# EAGLE design sphere_robo (EAGLE 8.2.2)
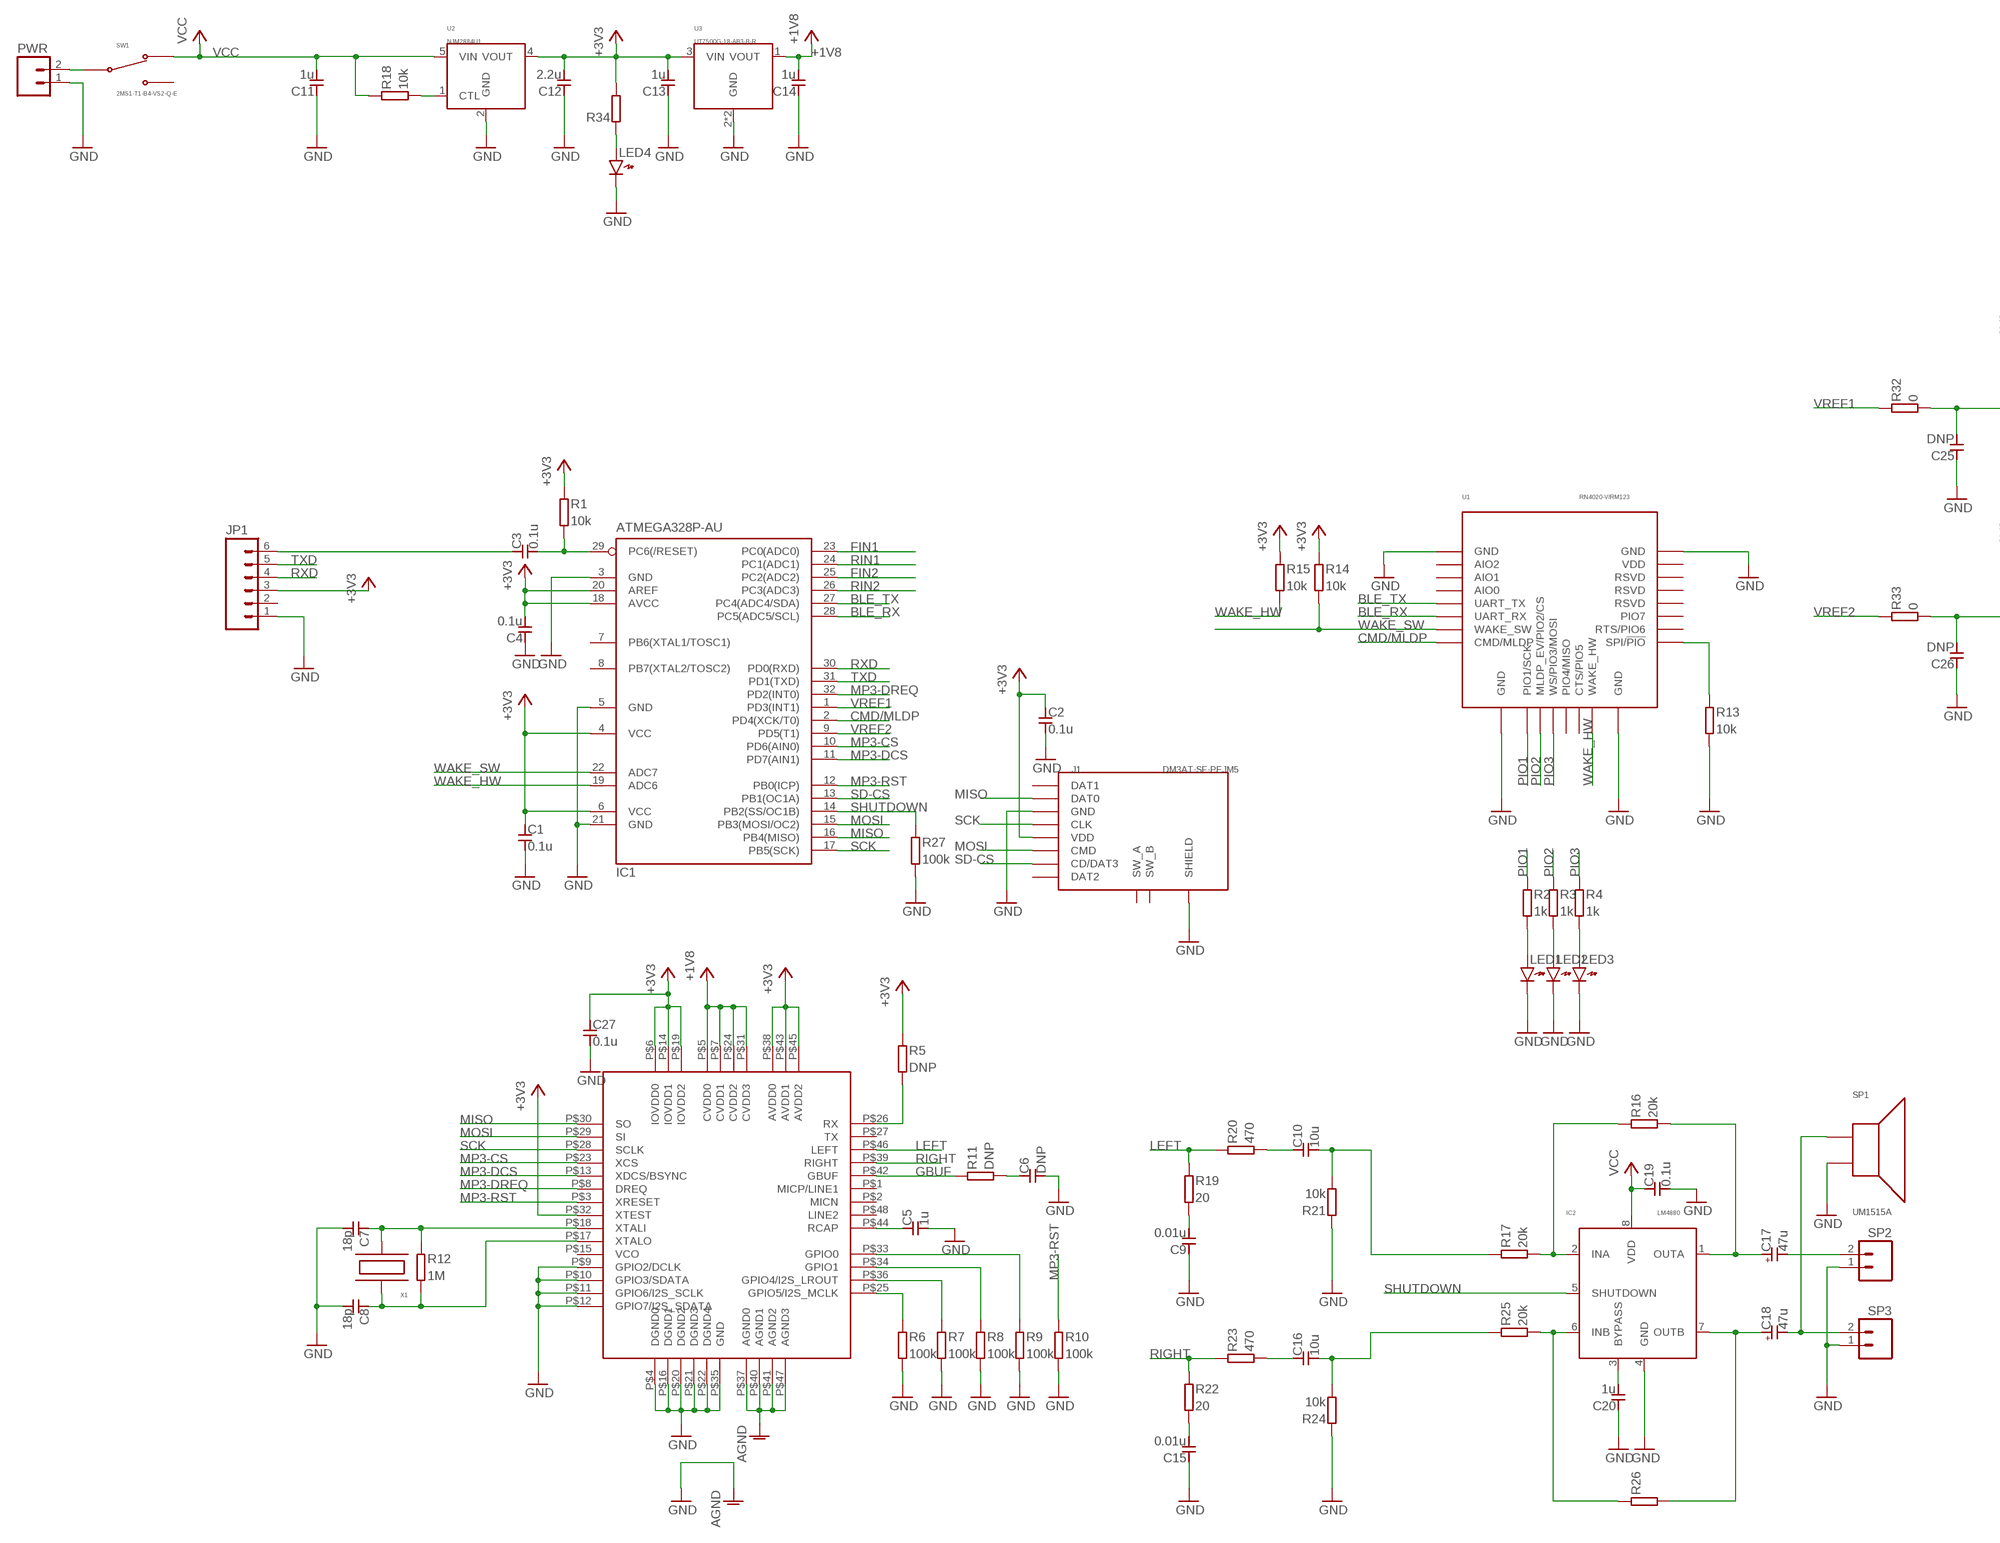
[diagram p0: schematic, sheet 1, part 1 of 2]
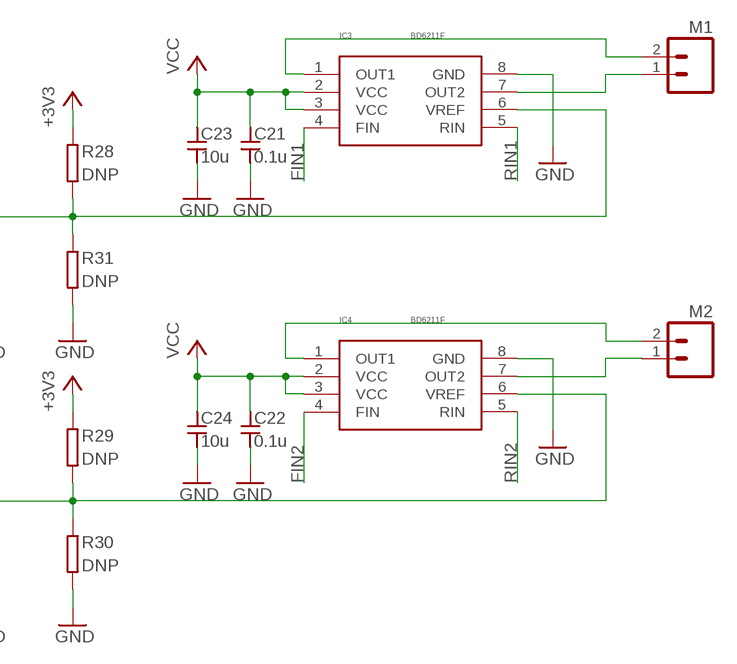
[diagram p1: schematic, sheet 1, part 2 of 2]

## Parts
C1  0.1u  CAPACITOR1608_REDUCED  [SMD1608_REDUCED]
C2  0.1u  CAPACITOR1608_REDUCED  [SMD1608_REDUCED]
C3  0.1u  CAPACITOR1608_REDUCED  [SMD1608_REDUCED]
C4  0.1u  CAPACITOR1608_REDUCED  [SMD1608_REDUCED]
C5  1u  CAPACITOR1608_REDUCED  [SMD1608_REDUCED]
C6  DNP  CAPACITOR1608_REDUCED  [SMD1608_REDUCED]
C7  18p  CAPACITOR1608_REDUCED  [SMD1608_REDUCED]
C8  18p  CAPACITOR1608_REDUCED  [SMD1608_REDUCED]
C9  0.01u  CAPACITOR1608_REDUCED  [SMD1608_REDUCED]
C10  10u  CAPACITOR2012_REDUCED  [SMD2012_REDUCED]
C11  1u  CAPACITOR1608_REDUCED  [SMD1608_REDUCED]
C12  2.2u  CAPACITOR1608_REDUCED  [SMD1608_REDUCED]
C13  1u  CAPACITOR1608_REDUCED  [SMD1608_REDUCED]
C14  1u  CAPACITOR1608_REDUCED  [SMD1608_REDUCED]
C15  0.01u  CAPACITOR1608_REDUCED  [SMD1608_REDUCED]
C16  10u  CAPACITOR2012_REDUCED  [SMD2012_REDUCED]
C17  47u  CAPACITOR-POLPANASONIC_F  [PANASONIC_F]
C18  47u  CAPACITOR-POLPANASONIC_F  [PANASONIC_F]
C19  0.1u  CAPACITOR1608_REDUCED  [SMD1608_REDUCED]
C20  1u  CAPACITOR1608_REDUCED  [SMD1608_REDUCED]
C21  0.1u  CAPACITOR1608_REDUCED  [SMD1608_REDUCED]
C22  0.1u  CAPACITOR1608_REDUCED  [SMD1608_REDUCED]
C23  10u  CAPACITOR2012_REDUCED  [SMD2012_REDUCED]
C24  10u  CAPACITOR2012_REDUCED  [SMD2012_REDUCED]
C25  DNP  CAPACITOR1608_REDUCED  [SMD1608_REDUCED]
C26  DNP  CAPACITOR1608_REDUCED  [SMD1608_REDUCED]
C27  0.1u  CAPACITOR1608_REDUCED  [SMD1608_REDUCED]
IC1  ATMEGA328P-AU  [TQFP32-08]
IC2  LM4880  [SOIC-8]
IC3  BD6211F  [SOP-8]
IC4  BD6211F  [SOP-8]
J1  DM3AT-SF-PEJM5  [DM3AT-SF-PEJM5]
JP1  M06NOSILK  [1X06-NOSILK]
LED1  LED1608_REDUCED  [LED1608_REDUCED]
LED2  LED1608_REDUCED  [LED1608_REDUCED]
LED3  LED1608_REDUCED  [LED1608_REDUCED]
LED4  LED1608_REDUCED  [LED1608_REDUCED]
M1  M02NOSILK  [1X02-NOSILK]
M2  M02NOSILK  [1X02-NOSILK]
PWR  M02NOSILK  [1X02-NOSILK]
R1  10k  RESISTOR1608_REDUCED  [SMD1608_REDUCED]
R2  1k  RESISTOR1608_REDUCED  [SMD1608_REDUCED]
R3  1k  RESISTOR1608_REDUCED  [SMD1608_REDUCED]
R4  1k  RESISTOR1608_REDUCED  [SMD1608_REDUCED]
R5  DNP  RESISTOR1608_REDUCED  [SMD1608_REDUCED]
R6  100k  RESISTOR1608_REDUCED  [SMD1608_REDUCED]
R7  100k  RESISTOR1608_REDUCED  [SMD1608_REDUCED]
R8  100k  RESISTOR1608_REDUCED  [SMD1608_REDUCED]
R9  100k  RESISTOR1608_REDUCED  [SMD1608_REDUCED]
R10  100k  RESISTOR1608_REDUCED  [SMD1608_REDUCED]
R11  DNP  RESISTOR1608_REDUCED  [SMD1608_REDUCED]
R12  1M  RESISTOR1608_REDUCED  [SMD1608_REDUCED]
R13  10k  RESISTOR1608_REDUCED  [SMD1608_REDUCED]
R14  10k  RESISTOR1608_REDUCED  [SMD1608_REDUCED]
R15  10k  RESISTOR1608_REDUCED  [SMD1608_REDUCED]
R16  20k  RESISTOR1608_REDUCED  [SMD1608_REDUCED]
R17  20k  RESISTOR1608_REDUCED  [SMD1608_REDUCED]
R18  10k  RESISTOR1608_REDUCED  [SMD1608_REDUCED]
R19  20  RESISTOR1608_REDUCED  [SMD1608_REDUCED]
R20  470  RESISTOR1608_REDUCED  [SMD1608_REDUCED]
R21  10k  RESISTOR1608_REDUCED  [SMD1608_REDUCED]
R22  20  RESISTOR1608_REDUCED  [SMD1608_REDUCED]
R23  470  RESISTOR1608_REDUCED  [SMD1608_REDUCED]
R24  10k  RESISTOR1608_REDUCED  [SMD1608_REDUCED]
R25  20k  RESISTOR1608_REDUCED  [SMD1608_REDUCED]
R26  RESISTOR1608_REDUCED  [SMD1608_REDUCED]
R27  100k  RESISTOR1608_REDUCED  [SMD1608_REDUCED]
R28  DNP  RESISTOR1608_REDUCED  [SMD1608_REDUCED]
R29  DNP  RESISTOR1608_REDUCED  [SMD1608_REDUCED]
R30  DNP  RESISTOR1608_REDUCED  [SMD1608_REDUCED]
R31  DNP  RESISTOR1608_REDUCED  [SMD1608_REDUCED]
R32  0  RESISTOR1608_REDUCED  [SMD1608_REDUCED]
R33  0  RESISTOR1608_REDUCED  [SMD1608_REDUCED]
R34  RESISTOR1608_REDUCED  [SMD1608_REDUCED]
SP1  UM1515A  [UM1515IA085008LFMP]
SP2  M02NOSILK  [1X02-NOSILK]
SP3  M02NOSILK  [1X02-NOSILK]
SW1  2MS1-T1-B4-VS2-Q-E  [2MS1-T1-B4-VS2-Q-E]
U1  RN4020-V/RM123  [RN4020]
U2  NJM2884U1  [SOT-89-5]
U3  UT7500G-18-AB3-B-R  [SOT-89]
U$1  VS1053B  [LQFP48]
X1  ABM2  [ABM2]

## Nets
+1V8: C14.2 U3.1(VOUT) U$1.P$5(CVDD0) U$1.P$7(CVDD1) U$1.P$24(CVDD2) U$1.P$31(CVDD3)
+3V3: C1.1 C2.1 C4.2 C12.2 C13.2 C27.1 IC1.4(VCC) IC1.6(VCC) IC1.18(AVCC) IC1.20(AREF) J1.4(VDD)(VDD) JP1.3 R1.1 R5.1 R14.1 R15.1 R28.1 R29.1 R34.2 U2.4(VOUT) U3.3(VIN) U$1.P$6(IOVDD0) U$1.P$14(IOVDD1) U$1.P$19(IOVDD2) U$1.P$32(XTEST) U$1.P$38(AVDD0) U$1.P$43(AVDD1) U$1.P$45(AVDD2)
BLE_RX: IC1.28(PC5(ADC5/SCL)) U1.6(UART_RX)
BLE_TX: IC1.27(PC4(ADC4/SDA)) U1.5(UART_TX)
CMD/MLDP: IC1.2(PD4(XCK/T0)) U1.8(CMD/MLDP)
FIN1: IC1.23(PC0(ADC0)) IC3.4(FIN)
FIN2: IC1.25(PC2(ADC2)) IC4.4(FIN)
GBUF: R11.1 U$1.P$42(GBUF)
GND: C1.2 C2.2 C4.1 C5.2 C6.2 C7.2 C8.2 C9.1 C11.1 C12.1 C13.1 C14.1 C15.1 C19.2 C20.1 C21.2 C22.2 C23.2 C24.2 C25.1 C26.1 C27.2 IC1.3(GND) IC1.5(GND) IC1.21(GND) IC2.4(GND) IC3.8(GND) IC4.8(GND) J1.6(GND)(GND) J1.SHIELD@1(SHIELD) J1.SHIELD@2(SHIELD) J1.SHIELD@3(SHIELD) J1.SHIELD@4(SHIELD) JP1.1 LED1.K LED2.K LED3.K LED4.K PWR.1 R6.2 R7.2 R8.2 R9.2 R10.2 R13.2 R21.1 R24.1 R27.2 R30.2 R31.2 SP1.2(-) SP2.1 SP3.1 U1.1(GND) U1.9(GND) U1.16(GND) U1.24(GND) U2.2(GND) U3.2(GND) U3.4(GND) U$1.P$4(DGND0) U$1.P$9(GPIO2/DCLK) U$1.P$10(GPIO3/SDATA) U$1.P$11(GPIO6/I2S_SCLK) U$1.P$12(GPIO7/I2S_SDATA) U$1.P$16(DGND1) U$1.P$20(DGND2) U$1.P$21(DGND3) U$1.P$22(DGND4) U$1.P$35(GND) U$1.P$37(AGND0) U$1.P$40(AGND1) U$1.P$41(AGND2) U$1.P$47(AGND3) ; supply symbol labelled AGND
INA: IC2.2(INA) R16.1 R17.2
INB: IC2.6(INB) R25.2 R26.1
LEFT: R19.1 R20.1 U$1.P$46(LEFT)
MISO: IC1.16(PB4(MISO)) J1.7(DAT0)(DAT0) U$1.P$30(SO)
MOSI: IC1.15(PB3(MOSI/OC2)) J1.3(CMD)(CMD) U$1.P$29(SI)
MP3-CS: IC1.10(PD6(AIN0)) U$1.P$23(XCS)
MP3-DCS: IC1.11(PD7(AIN1)) U$1.P$13(XDCS/BSYNC)
MP3-DREQ: IC1.32(PD2(INT0)) U$1.P$8(DREQ)
MP3-RST: IC1.12(PB0(ICP)) R10.1 U$1.P$3(XRESET)
N$1: C3.2 IC1.29(PC6(/RESET)) R1.2
N$2: C3.1 JP1.6
N$3: LED1.A R2.2
N$4: LED2.A R3.2
N$5: LED3.A R4.2
N$6: R6.1 U$1.P$25(GPIO5/I2S_MCLK)
N$7: R7.1 U$1.P$36(GPIO4/I2S_LROUT)
N$8: R8.1 U$1.P$34(GPIO1)
N$9: R9.1 U$1.P$33(GPIO0)
N$10: C5.1 U$1.P$44(RCAP)
N$11: R13.1 U1.17(SPI/!PIO)
N$12: R5.2 U$1.P$26(RX)
N$13: PWR.2 SW1.2
N$14: C18.- SP1.1(+) SP3.2
N$15: C7.1 R12.1 U$1.P$18(XTALI) X1.2
N$16: C9.2 R19.2
N$17: C6.1 R11.2
N$18: R18.2 U2.1(CTL)
N$19: C8.1 R12.2 U$1.P$17(XTALO) X1.1
N$20: C10.1 R20.2
N$21: C10.2 R17.1 R21.2
N$23: C15.2 R22.2
N$24: C16.1 R23.2
N$25: C16.2 R24.2 R25.1
N$26: C20.2 IC2.3(BYPASS)
N$29: C17.- SP2.2
N$31: LED4.A R34.1
N$35: C25.2 IC3.6(VREF) R28.2 R31.1 R32.2
N$36: C26.2 IC4.6(VREF) R29.2 R30.1 R33.2
N$37: IC4.1(OUT1) M2.2
N$38: IC4.7(OUT2) M2.1
N$39: IC3.1(OUT1) M1.2
N$40: IC3.7(OUT2) M1.1
OUTA: C17.+ IC2.1(OUTA) R16.2
OUTB: C18.+ IC2.7(OUTB) R26.2
PIO1: R2.1 U1.10(PIO1/SCK)
PIO2: R3.1 U1.11(MLDP_EV/PIO2/CS)
PIO3: R4.1 U1.12(WS/PIO3/MOSI)
RIGHT: R22.1 R23.1 U$1.P$39(RIGHT)
RIN1: IC1.24(PC1(ADC1)) IC3.5(RIN)
RIN2: IC1.26(PC3(ADC3)) IC4.5(RIN)
RXD: IC1.30(PD0(RXD)) JP1.4
SCK: IC1.17(PB5(SCK)) J1.5(CLK)(CLK) U$1.P$28(SCLK)
SD-CS: IC1.13(PB1(OC1A)) J1.2(CD/DAT3)(CD/DAT3)
SHUTDOWN: IC1.14(PB2(SS/OC1B)) IC2.5(SHUTDOWN) R27.1
TXD: IC1.31(PD1(TXD)) JP1.5
VCC: C11.2 C19.1 C21.1 C22.1 C23.1 C24.1 IC2.8(VDD) IC3.2(VCC) IC3.3(VCC) IC4.2(VCC) IC4.3(VCC) R18.1 SW1.1 U2.5(VIN)
VREF1: IC1.1(PD3(INT1)) R32.1
VREF2: IC1.9(PD5(T1)) R33.1
WAKE_HW: IC1.19(ADC6) R15.2 U1.15(WAKE_HW)
WAKE_SW: IC1.22(ADC7) R14.2 U1.7(WAKE_SW)
Unconnected: IC1.7(PB6(XTAL1/TOSC1)) IC1.8(PB7(XTAL2/TOSC2)) J1.1(DAT2)(DAT2) J1.8(DAT1)(DAT1) J1.SW_A J1.SW_B JP1.2 SW1.3 U1.2(AIO2) U1.3(AIO1) U1.4(AIO0) U1.13(PIO4/MISO) U1.14(CTS/PIO5) U1.18(RTS/PIO6) U1.19(PIO7) U1.20(RSVD) U1.21(RSVD) U1.22(RSVD) U1.23(VDD) U$1.P$1(MICP/LINE1) U$1.P$2(MICN) U$1.P$15(VCO) U$1.P$27(TX) U$1.P$48(LINE2)

## Library data of the parts
C1-C16 C19-C27 = generic:CAPACITOR: Generic Capacitor
C17 C18 = generic:CAPACITOR-POL: Generic Capacitor with Polarity
IC1 = AVR:ATMEGA328P-AU: AVR ATMEGA328P-AU AKIZUKI CODE I-04386
IC2 = audio_amp:LM4880: TI dual audio amp 250mW
IC3 IC4 = motor_driver:BD6211: ROHM Motor driver
J1 = SDcard:DM3AT
JP1 = header:M06
LED1-LED4 = generic:LED: Generic LEDs
M1 M2 PWR SP2 SP3 = header:M02
R1-R34 = generic:RESISTOR: Generic Registor
SP1 = speaker:UM1515A: SMD Speaker akizuki : P-06707 0.5W 8ohm
SW1 = switch:2MS1-T1-B4-VS2-Q-E: Toggle Switch ON-ON akizuki: P-00300
U1 = com_module:RN4020: Bluetooth Low Energy Module Microchip
U2 = LDO:NJM2884U1: JRC LDO Io(max ) = 500mA akizuki : I-10896
U3 = LDO:UT7500G: LDO Io: 100mA
U$1 = MP3:VS1053B
X1 = crystal:ABM2: ABRACON Crystal

## Board
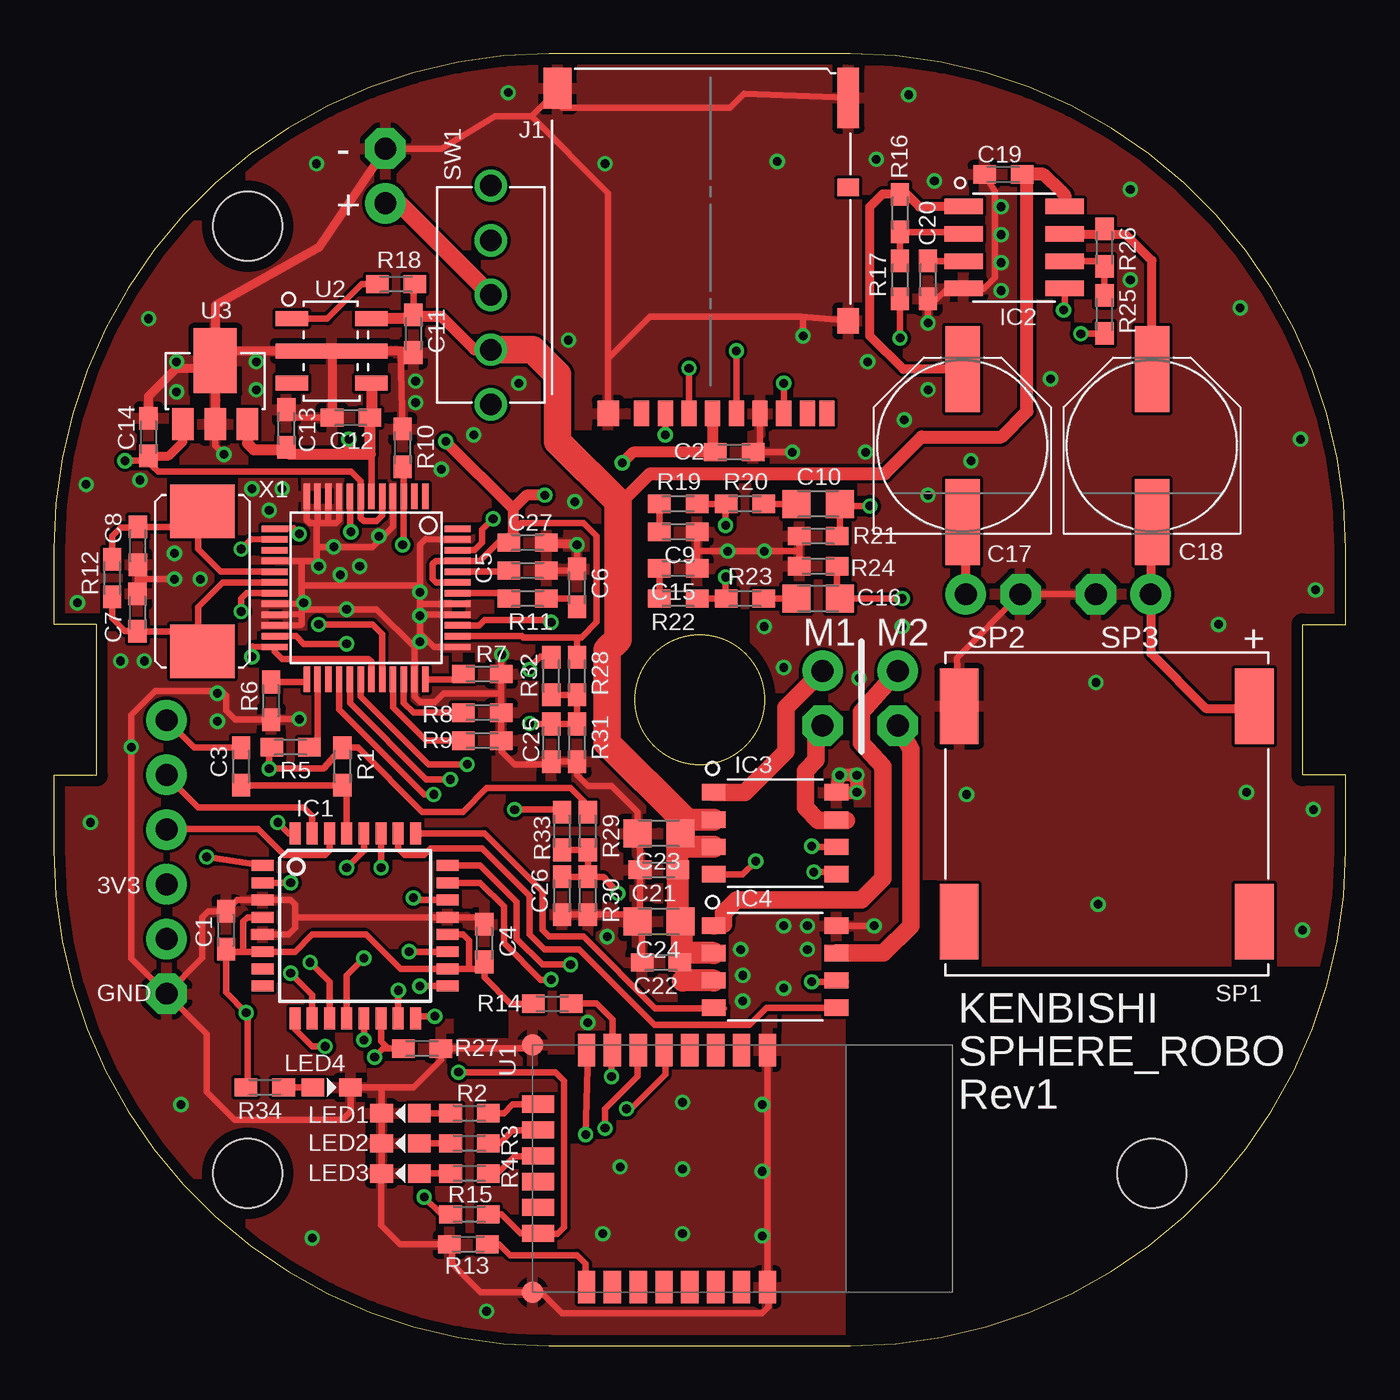
[diagram p2: board, top side]
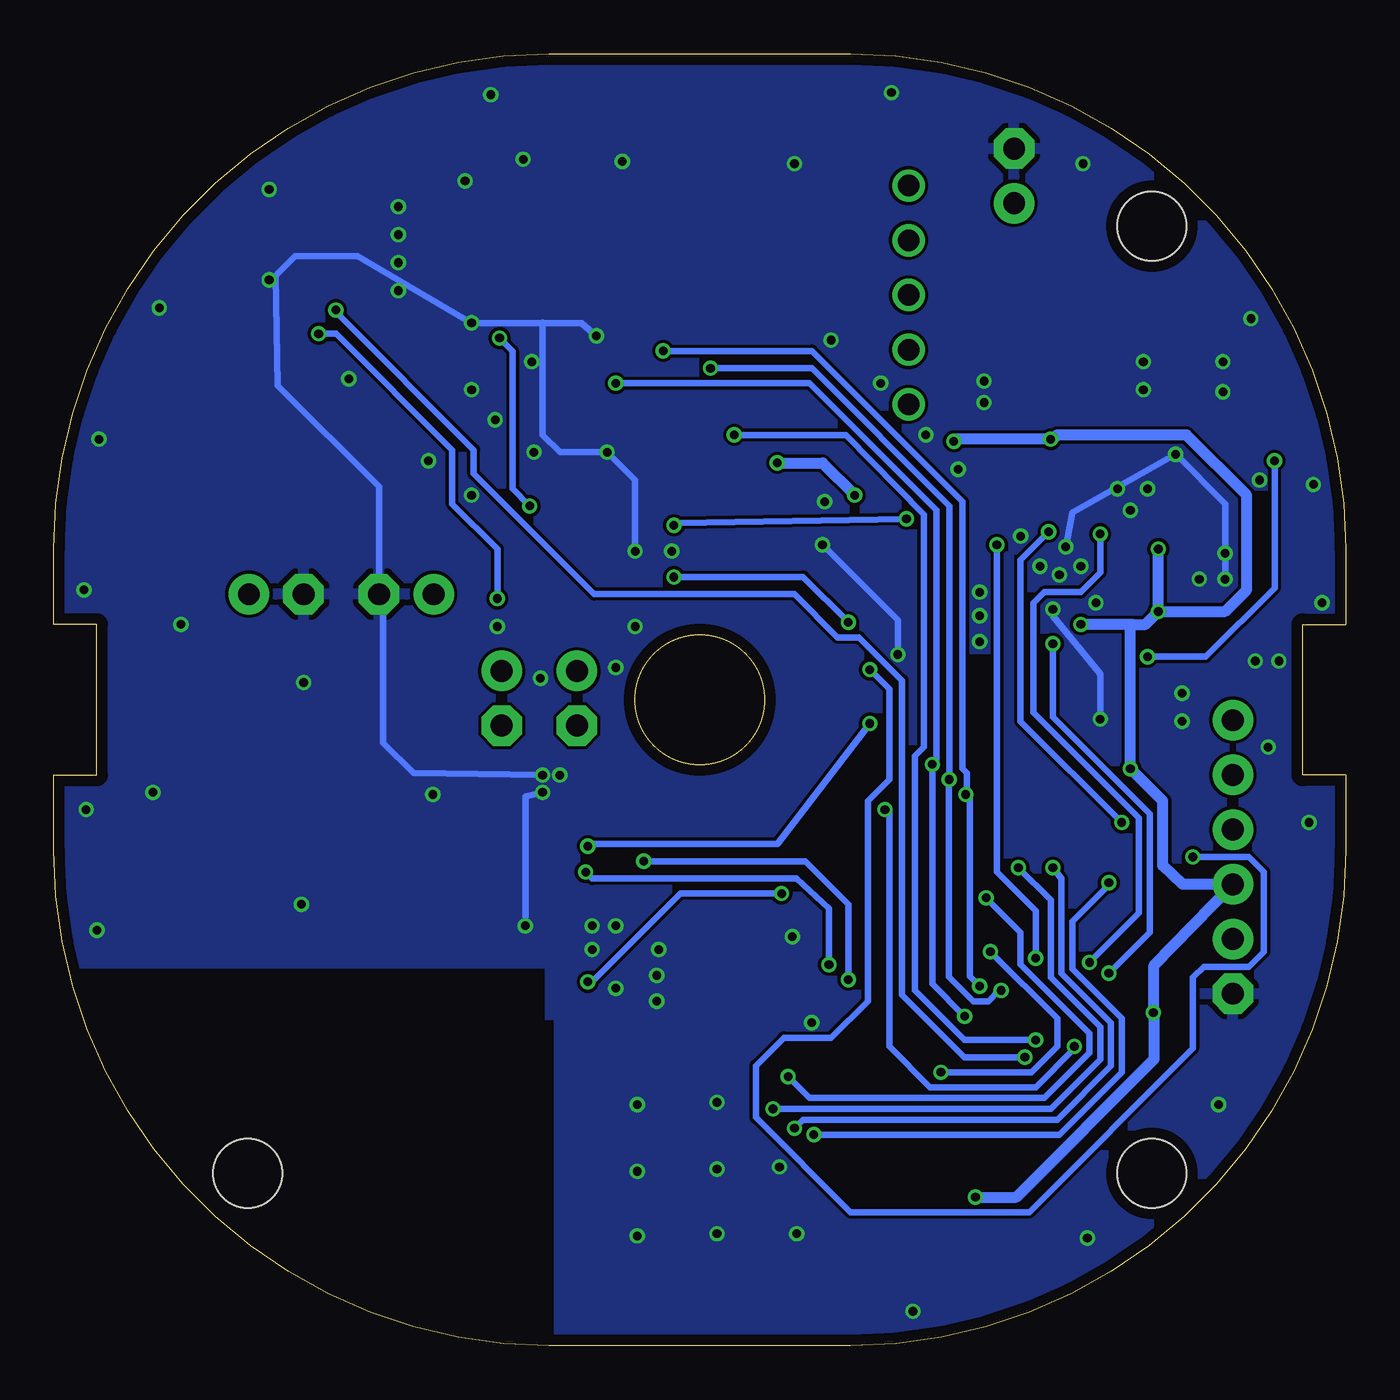
[diagram p3: board, bottom side, seen from below]

Size 60 x 60 mm. Coordinates in mm from the lower left corner, seen from the top.
Outline: 0,26.5 0,23 arc90 23,0 37,0 arc90 60,23 60,26.5 58,26.5 58,33.5 60,33.5 60,37 arc90 37,60 23,60 arc90 0,37 0,33.5 2,33.5 2,26.5 0,26.5
Outline: circle at 30,30 radius 3
Copper layers (1*16): Top 0.035mm / dielectric 1.6mm / Bottom 0.035mm
Design rules "Elecrow_2-layer_PCB_eagle_rule": minimum track width 6mil, minimum drill 12mil, track to track 6mil, track to pad 6mil, pad to pad 6mil, via to via 8mil, smd to smd 0mil, copper to edge 20mil, drill to drill 10mil, minimum pad ring 6mil, minimum via ring 6mil, stop-mask expansion 0mil, vias tented up to drill 100mil, thermal gap 10mil
Holes 3.2 mm at 9,8 51,8 9,52
tRestrict: area 36.8,0 to 60.8,15.1; area 37.1,14.6 to 60.8,17.6; area 18.6,14.3 to 21.1,15.6; area 22.8,13.2 to 24.1,13.5; area 37.1,24.7 to 38,25; area 32.2,32.7 to 32.3,34.2; area 10,34.1 to 10.6,34.2; area 10,33.6 to 10.6,33.7; area 11.9,39.1 to 12,39.7; area 12.9,39.1 to 13,39.8; area 12,39.1 to 12.1,39.7; area 12.4,39.1 to 12.6,39.8; 8 more areas
bRestrict: area 36.8,0 to 60.7,15.1; area 37.2,14.7 to 60.8,17.5; area 3.6,39.3 to 4.2,39.7; area 16.5,31.9 to 17.4,32.1

### Footprints (pad centres in the part's own frame; a part is rotated, then mirrored left to right if it is on the bottom)
SMD1608_REDUCED = smd 1.05 x 0.85: 1 -0.875,0; 2 0.875,0
SMD2012_REDUCED = smd 1.3 x 1.3: 1 -1,0; 2 1,0
PANASONIC_F = smd 4 x 1.6: + 3.55,0; - -3.55,0
TQFP32-08 = smd 1.016 x 0.508: 1 -4.293,2.8; 2 -4.293,2; 3 -4.293,1.2; 4 -4.293,0.4; 5 -4.293,-0.4; 6 -4.293,-1.2; 7 -4.293,-2; 8 -4.293,-2.8; 17 4.293,-2.8; 18 4.293,-2; 19 4.293,-1.2; 20 4.293,-0.4; 21 4.293,0.4; 22 4.293,1.2; 23 4.293,2; 24 4.293,2.8 | smd 0.508 x 1.016: 9 -2.8,-4.293; 10 -2,-4.293; 11 -1.2,-4.293; 12 -0.4,-4.293; 13 0.4,-4.293; 14 1.2,-4.293; 15 2,-4.293; 16 2.8,-4.293; 25 2.8,4.293; 26 2,4.293; 27 1.2,4.293; 28 0.4,4.293; 29 -0.4,4.293; 30 -1.2,4.293; 31 -2,4.293; 32 -2.8,4.293
SOIC-8 = smd 0.72 x 1.78: 1 -1.905,-2.35; 2 -0.635,-2.35; 3 0.635,-2.35; 4 1.905,-2.35; 5 1.905,2.35; 6 0.635,2.35; 7 -0.635,2.35; 8 -1.905,2.35
SOP-8 = smd 1.1 x 0.76: 1 -2.85,1.905; 2 -2.85,0.635; 3 -2.85,-0.635; 4 -2.85,-1.905; 5 2.85,-1.905; 6 2.85,-0.635; 7 2.85,0.635; 8 2.85,1.905
DM3AT-SF-PEJM5 = smd 0.7 x 1.2: 1(DAT2) 0,0.6; 2(CD/DAT3) -1.1,0.6; 3(CMD) -2.2,0.6; 4(VDD) -3.3,0.6; 5(CLK) -4.4,0.6; 6(GND) -5.5,0.6; 7(DAT0) -6.6,0.6; 8(DAT1) -7.7,0.6; SW_B -8.6,0.6 | smd 1 x 2.8: SHIELD@1 -9.6,-14.05 | smd 1.3 x 1.9: SHIELD@2 3.9,-14.5 | smd 1 x 1.2: SHIELD@3 1.55,0.6; SHIELD@4 -9.6,-3.7 | smd 1 x 0.8: SW_A -9.6,-9.9
1X06-NOSILK = drill 1.016 pad 1.88 octagon: 1 0,0 | drill 1.016 pad 1.88: 2 2.54,0; 3 5.08,0; 4 7.62,0; 5 10.16,0; 6 12.7,0
LED1608_REDUCED = smd 1.05 x 0.85: A -0.875,0; K 0.875,0
1X02-NOSILK = drill 1.016 pad 1.88 octagon: 1 0,0 | drill 1.016 pad 1.88: 2 2.54,0
UM1515IA085008LFMP = smd 1.8 x 3.5: 1 -6.85,-5; 2 6.85,-5; 3 6.85,5; 4 -6.85,5
2MS1-T1-B4-VS2-Q-E = drill 1: 1 -2.54,0; 2 0,0; 3 2.54,0; 4 5.08,0; 5 -5.08,0
RN4020 = smd 1.5 x 0.8: 1 0.25,10.9; 2 0.25,9.7; 3 0.25,8.5; 4 0.25,7.3; 5 0.25,6.1; 6 0.25,4.9; 7 0.25,3.7; 8 0.25,2.5; 17 11.25,2.5; 18 11.25,3.7; 19 11.25,4.9; 20 11.25,6.1; 21 11.25,7.3; 22 11.25,8.5; 23 11.25,9.7; 24 11.25,10.9 | smd 1 x 1: 9 0,0; 16 11.5,0 | smd 0.8 x 1.5: 10 2.75,0.25; 11 3.95,0.25; 12 5.15,0.25; 13 6.35,0.25; 14 7.55,0.25; 15 8.75,0.25
SOT-89-5 = smd 0.7 x 1.5: 1 -1.5,-1.85; 3 1.5,-1.85; 4 1.5,1.85; 5 -1.5,1.85 | smd 0.7 x 5.2: 2 0,0
SOT-89 = smd 1 x 1.5: 1 -1.5,-2; 2 0,-2; 3 1.5,-2 | smd 2 x 3: 4 0,0.95
LQFP48 = smd 0.3 x 1.2: P$1 -2.75,-4.25; P$2 -2.25,-4.25; P$3 -1.75,-4.25; P$4 -1.25,-4.25; P$5 -0.75,-4.25; P$6 -0.25,-4.25; P$7 0.25,-4.25; P$8 0.75,-4.25; P$9 1.25,-4.25; P$10 1.75,-4.25; P$11 2.25,-4.25; P$12 2.75,-4.25; P$25 2.75,4.25; P$26 2.25,4.25; P$27 1.75,4.25; P$28 1.25,4.25; P$29 0.75,4.25; P$30 0.25,4.25; P$31 -0.25,4.25; P$32 -0.75,4.25; P$33 -1.25,4.25; P$34 -1.75,4.25; P$35 -2.25,4.25; P$36 -2.75,4.25 | smd 1.2 x 0.3: P$13 4.25,-2.75; P$14 4.25,-2.25; P$15 4.25,-1.75; P$16 4.25,-1.25; P$17 4.25,-0.75; P$18 4.25,-0.25; P$19 4.25,0.25; P$20 4.25,0.75; P$21 4.25,1.25; P$22 4.25,1.75; P$23 4.25,2.25; P$24 4.25,2.75; P$37 -4.25,2.75; P$38 -4.25,2.25; P$39 -4.25,1.75; P$40 -4.25,1.25; P$41 -4.25,0.75; P$42 -4.25,0.25; P$43 -4.25,-0.25; P$44 -4.25,-0.75; P$45 -4.25,-1.25; P$46 -4.25,-1.75; P$47 -4.25,-2.25; P$48 -4.25,-2.75
ABM2 = smd 2.5 x 3: 1 -3.25,0; 2 3.25,0

### Placement (x,y rotation side)
C1  8,19.3 90 top
C2  31.6,41.5 0 top
C3  8.7,26.9 270 top
C4  20,18.7 270 top
C5  22,36 0 top
C6  24.3,35.2 90 top
C7  3.89,34.05 90 top
C8  3.9,37.15 270 top
C9  29,37.8 180 top
C10  35.5,39.1 0 top
C11  16.7,47 90 top
C12  13.8,43.1 0 top
C13  10.8,42.6 270 top
C14  4.4,42.2 270 top
C15  29,36.1 180 top
C16  35.5,34.7 0 top
C17  42.2,41.8 90 top
C18  51,41.8 90 top
C19  44.1,54.4 180 top
C20  40.6,49.5 90 top
C21  28.1,22.1 180 top
C22  28.2,17.8 180 top
C23  28.1,23.8 180 top
C24  28.1,19.7 180 top
C25  23.1,28 90 top
C26  23.6,20.9 90 top
C27  22,37.3 0 top
IC1  14,19.5 0 top
IC2  44.6,51 270 top
IC3  33.5,23.8 0 top
IC4  33.5,17.6 0 top
J1  27.3,43.9 180 top
JP1  5.24,16.35 90 top
LED1  16.1,10.8 180 top
LED2  16.1,9.4 180 top
LED3  16.1,8 180 top
LED4  12.9,12 0 top
M1  35.7,28.8 90 top
M2  39.2,28.8 90 top
PWR  15.4,55.6 270 top
R1  13.4,26.9 270 top
R2  19.3,10.8 180 top
R3  19.3,9.4 180 top
R4  19.3,8 180 top
R5  11,27.8 0 top
R6  10.09,29.95 270 top
R7  19.9,31.2 0 top
R8  19.9,29.4 0 top
R9  19.9,28.1 0 top
R10  16.2,41.7 90 top
R11  22,34.7 0 top
R12  2.71,35.65 90 top
R13  19.25,4.71 180 top
R14  23.15,15.88 0 top
R15  19.3,6.1 0 top
R16  39.3,52.6 90 top
R17  39.3,49.5 90 top
R18  15.9,49.3 180 top
R19  29,39.1 180 top
R20  32.1,39.1 0 top
R21  35.5,37.6 0 top
R22  29,34.7 180 top
R23  32.1,34.7 0 top
R24  35.5,36.2 0 top
R25  48.8,47.9 90 top
R26  48.8,51 90 top
R27  17.1,13.8 0 top
R28  24.3,31.1 270 top
R29  24.8,23.9 270 top
R30  24.8,20.9 270 top
R31  24.3,28 270 top
R32  23.1,31.1 270 top
R33  23.6,23.9 270 top
R34  9.8,12 180 top
SP1  48.9,24.7 180 top
SP2  44.9,34.9 180 top
SP3  48.4,34.9 0 top
SW1  20.3,48.8 90 top
U1  22.24,13.97 270 top
U2  12.9,46.2 270 top
U3  7.5,44.8 0 top
U$1  14.5,35.2 180 top
X1  6.9,35.5 270 top

### Tracks (layer width: path | path; a pad name or v marks a point on that pad's centre or on a via)
+1V8  (via drill 0.4)
  Top 0.305: 4.3,41.1 4.3,41.41 C14.2 | U$1.P$31 14.75,31.75 14.6,31.9 10.6,31.9 10.25,32.25 U$1.P$24 9.23,32.47 9.23,32.03 v9.2,32 | U$1.P$5 15.25,38.55 15,38.3 14.4,38.3 14.25,38.45 U$1.P$7 14.25,40.15 13.8,40.6 4.84,40.6 4.3,41.1 | v3.3,41.1 4.3,41.1
  Top 0.406: C14.2 5.33,41.33 6,42 U3.1
  Bottom 0.305: v9.2,32 6.5,32 3.3,35.2 v3.3,41.1
+3V3  (via drill 0.4)
  Top 0.305: U$1.P$14 9.17,37.47 v8.7,37 | U$1.P$6 14.75,41.7 14.7,41.4 | 13.7,41.43 13.73,41.4 | R5.1 10.1,27.7 10,27.7 v10,26.8 12.53,26.8 R1.1 14.12,27.77 17.1,24.8 19,24.8 20.1,25.9 24,25.9 24.7,25.2 R29.1 24.7,24.88 | 8.81,18.3 IC1.6 11.2,18.3 12,19.1 14.5,19.1 16.1,17.5 IC1.18 19.29,17.5 | 8.81,18.3 8.41,18.3 C1.1 8,16.4 v8.93,15.47 9,15.4 9,12.12 8.9,12.03 R34.2 | 8.81,18.3 8.8,18.31 8.8,19.7 9,19.9 IC1.4 | 19.29,17.5 19.77,17.5 19.98,17.71 | 19.98,17.71 C4.2 | v12.3,33.5 14.8,33.5 15.25,33.05 U$1.P$32 | 30.6,41.62 C2.1 | R14.1 21.22,15.88 20,17.1 C4.2 | C4.2 20,18.1 19.98,17.71 | 10.68,41.6 C13.2 10.8,41.58 | U$1.P$19 8.95,34.95 8.7,34.7 v8.7,34.1 | IC1.20 19,19.1 19.29,18.81 19.29,17.5 | U$1.P$43 17.75,35.45 17.6,35.6 17.6,36.3 17.75,36.45 U$1.P$45 19.77,36.45 20.62,37.3 C27.1 21.12,37.62 21.7,38.2 24.6,38.2 25.2,37.6 25.2,33.6 24.5,32.9 24.18,32.9 | U$1.P$38 21.75,32.95 21.8,32.9 24.18,32.9 | 24.24,32.36 24.3,32.3 R28.1 24.3,32.78 24.18,32.9 | v17.2,6.9 18,6.1 R15.1 | v26.4,41
  Top 0.406: 14.75,43.17 C12.2 14.7,43.1
  Top 0.508: U2.4 14.75,43.17 | 14.7,43.1 14.7,41.4 13.73,41.4 10.97,41.4 10.8,41.58 | U3.3 9,41.9 9.3,41.6 10.68,41.6 | 21.3,37.4 21.3,37.5 | 21.3,37.4 21.2,37.3 C27.1 | v13.7,42.1 13.7,41.43 | J1.4(VDD) 30.6,41.62 | C2.1 26.9,41.5 v26.4,41 | v18.2,42 21.32,38.88 | v22.8,39.5 21.95,39.5 21.32,38.88 | 21.32,38.88 21.32,37.42 21.3,37.4
  Bottom 0.305: 13.7,42 v13.7,42.1 | 10,33.42 9.92,33.5 | 18.1,42.1 v18.2,42 18,41.9 | v8.93,15.47 8.99,15.47 8.9,15.46
  Bottom 0.508: v8.7,34.1 v8.7,37 | v8.7,34.1 5.6,34.1 4.6,35.1 4.6,39.5 7.4,42.3 13.4,42.3 13.7,42 | v26.4,41 24.3,41 v22.8,39.5 | v12.3,33.5 9.92,33.5 9.3,33.5 v8.7,34.1 | 10,33.42 v10,26.8 8.5,25.3 8.5,22.3 7.57,21.43 JP1.3 8.9,17.67 8.9,15.46 8.9,13.3 15.3,6.9 v17.2,6.9 | v13.7,42.1 18.1,42.1
BLE_RX  (via drill 0.4)
  Top 0.305: IC1.28 14.4,23 v13.6,22.2 | v25.6,10.1 25.6,11 27.1,12.5 27.1,13.68 U1.6
  Bottom 0.305: v13.6,22.2 13.2,21.7 13.2,17.3 10.9,15 10.9,13 13.4,10.5 25.2,10.5 v25.6,10.1
BLE_TX  (via drill 0.4)
  Top 0.305: v26.6,11 26.8,11 28.4,12.6 28.4,13.66 U1.5 | IC1.27 v15.2,22.2
  Bottom 0.305: v15.2,22.2 13.7,20.7 13.7,17.1 11.4,14.8 11.4,13.3 13.7,11 v26.6,11 26.6,11.1
CMD/MLDP  (via drill 0.4)
  Top 0.305: U1.8 24.8,13.66 v24.7,9.8 | v11,21.5 IC1.2
  Bottom 0.305: v24.7,9.8 13.3,9.8 10.4,12.7 10.4,15.2 12.7,17.5 12.7,19.7 10.9,21.5 v11,21.5
FIN1  (via drill 0.4)
  Top 0.305: IC1.23 19.8,21.5 20.9,20.4 20.9,18.7 22.6,17 v23.1,17 | IC3.4 32,21.89 v32.6,22.5
  Bottom 0.305: v23.1,17 23.1,20.5 25.1,22.5 v32.6,22.5
FIN2
  Top 0.305: IC1.25 20,23.8 22.7,21.1 22.7,19.3 23,19 24.6,19 27.93,15.68 31.13,15.68 | 31.13,15.68 IC4.4 | 31.13,15.68 31.05,15.6
GBUF
  Top 0.305: U$1.P$42 20.88,34.95 R11.1
GND  (via drill 0.4)
  Top 0.305: U$1.P$9 13.25,38.35 13.1,38.2 12.63,38.2 | 11.97,38.2 12.26,38.2 | 11.97,38.2 11.9,38.2 11.75,38.35 U$1.P$12 | 12.63,38.2 12.26,38.2 | U$1.P$11 12.25,38.2 12.26,38.2 | U$1.P$10 12.75,38.32 12.63,38.2 | 12.2,37.1 12.2,36.5 12.15,36.45 11.52,36.45 | 11.97,38.2 12.2,38.17 12.2,37.1 | 11.47,34.47 U$1.P$20 | 11.47,34.47 11.5,34.5 11.5,35.3 | 11.47,33.97 U$1.P$21 | 11.47,33.97 11.5,34 11.5,34.15 | 11.5,34.15 11.5,34.44 11.47,34.47 | U$1.P$22 11.47,33.47 11.5,33.5 11.5,33.94 11.47,33.97 | U$1.P$4 15.75,38.05 14.8,37.1 v13,37.1 12.2,37.1 | U3.2 7.5,41.8 v7.9,41.4 | C8.2 3.9,35.6 | 3.9,35.6 3.9,34.94 C7.2 | 3.9,35.6 v5.6,35.6 | C12.1 11.18,43.1 C13.1 | C27.2 23.12,37.25 | 11.2,19.88 11.2,20.5 11,20.7 IC1.3 8.53,20.7 C1.2 7.17,20.18 6.9,19.9 6.9,18.01 JP1.1 | 11.2,19.88 11.2,19.4 10.9,19.1 IC1.5 | C4.1 19.86,19.9 IC1.21 11.22,19.9 11.2,19.88 | JP1.1 3.6,17.99 v3.6,27.8 3.6,29.3 4.7,30.4 7.8,30.4 8,30.2 8,29.5 8.43,29.07 R6.2 10.12,29.1 v11.4,29.1 | R9.2 20.73,27.75 | R10.2 16.1,46.15 16.15,46.2 | J1.6(GND) 32.8,41.83 C2.2 v34.3,41.5 | 34.69,47.8 27.7,47.8 25.75,45.85 J1.SHIELD@3 25.75,53.53 22.18,57.1 | 34.69,47.8 J1.SHIELD@4 | J1.SHIELD@1 32.05,58.15 31.4,57.5 23.6,57.5 23.3,57.8 23.3,58.22 | 23.3,58.22 23.3,58.5 J1.SHIELD@2 | PWR.1 18,55.6 20.5,57.1 22.18,57.1 | 22.18,57.1 23.3,58.22 | R24.1 34.62,36.9 | 34.62,36.9 R21.1 | C19.2 43.7,53.62 43.7,49.6 43.2,49.09 IC2.4 42.15,49 41.4,49 41.02,48.62 C20.1 v40.6,47.5 40.7,47.5 | SP3.1 SP2.1 41.95,31.95 SP1.2 | C22.2 27.32,18.98 27.31,19.19 | 27.31,19.19 C24.2 26.73,20.02 R30.2 C26.1 | v34.8,46.9 34.8,47.69 34.69,47.8 | U1.9 21.97,13.8 R27.2 17.98,13.28 16.7,12 15.08,12
  Top 0.305: 15.08,12 LED4.K 13.78,10.88 13.4,10.5 8.4,10.5 7.1,11.8 7.1,14.49 JP1.1 | 15.08,12 15.22,11.85 LED1.K LED2.K LED3.K 15.2,7.97 15.2,5.6 16.09,4.71 R13.2 18.5,4.49 18.5,3.8 19.83,2.47 U1.16 22.63,2.47 23.6,1.5 32.9,1.5 33.2,1.8 33.2,2.66 U1.24 U1.1 | 34.62,36.9 v33,36.9 v31.3,36.9 29.95,36.9 29.88,36.97 | IC4.8 v38.09,19.5 v38.1,19.5 | 27.25,24.16 C23.2 27.23,23.77 C21.2 27.23,19.3 27.31,19.19 | 27.25,24.16 27.3,24.3 | R9.2 20.8,27.6 21.4,27 23.07,27 C25.1 R31.2 24.3,26.5 24.8,26 25.9,26 27.1,24.8 27.1,24.31 27.25,24.16 | v24.3,37.2 C6.2 24.23,36 C5.2 | v20.8,32.1 20.77,31.93 R7.2 20.77,30.25 | U$1.P$47 17.27,37.47 17,37.2 17,35.35 | 11.5,35.3 16.85,35.3 17,35.35 | 11.5,34.15 11.55,34.2 v13.6,34.2 15,34.2 16.75,32.45 U$1.P$35 16.75,30.15 17,29.9 17.7,29.9 18.1,30.3 20.73,30.3 20.77,30.25 | 20.77,30.25 R8.2 R9.2 | U$1.P$37 17.65,32.45 17,33.1 v17,33.9 17,34 | 17,34 17,34.51 | 17,34.51 v17,35 17,35.35 | U$1.P$41 17.06,34.45 17,34.51 | U$1.P$40 17.05,33.95 17,34 | 29.88,36.97 C9.1 | 29.88,36.97 C15.1 | 11.52,36.45 U$1.P$16 | 11.52,36.45 11.5,36.43 11.5,35.3
  Top 0.406: U2.2 16.15,46.2 16.62,46.2 C11.1 | U2.2 7.95,46.2 U3.4 | 7.5,45.61 U3.4 | 7.5,45.61 U3.2 | U2.2 12.93,46.17 C12.1 12.9,43.08 | PWR.1 12.3,51 7.5,48.3 U3.4 | C14.1 4.4,44.1 5.7,45.4 7.29,45.4 7.5,45.61 | 23.12,37.25 24.18,37.25 arc-45 v24.3,37.2
  Top 0.61: 36.45,26.45 IC3.8 37.4,25.7 v37.3,25.7 v37.3,26.5 37,26.5 36.45,26.45 | 36.45,26.45 36.6,26.5 v36.5,26.5
  Bottom 0.305: v13,37.1 12.7,38.7 v7.9,41.4 5.6,39.1 v5.6,36.8 v5.6,35.6 | 37.22,47.5 v40.6,47.5 45.9,50.6 48.8,50.6 49.7,49.7 49.6,44.6 44.9,39.9 SP2.1 44.7,34.7 44.7,28 43.3,26.6 v37.3,26.5 | 37.22,47.5 35.5,47.5 v34.8,46.9 | 37.22,47.5 37.3,47.52 37.3,42.3 36.5,41.5 v34.3,41.5 33,40.2 v33,36.9 | v38.1,19.5 38.1,25.5 v37.3,25.7 | v11.4,29.1 11.4,31.2 13.6,33.9 v13.6,34.2 | v24.3,37.2 20.8,33.7 v20.8,32.1
  other vias: 21.1,58.2 12.2,54.9 4.4,47.7 1.5,40 1.1,34.5 25.6,54.9 33.6,55 39.7,58.1 38.2,55.1 40.9,54.1 50,53.7 55.1,48.2 50,49.5 46.3,44.9 57.9,42.1 42.6,41.1 40.6,39.5 33,33.4 39.4,33.4 33.9,31.5 37.4,31 48.4,30.8 54.1,33.5 58.6,35.1 58,19.3 58.5,24.9 55.4,25.7 48.5,20.5 42.4,25.6 32.9,11.2 32.9,8.1 32.9,5.1 29.2,11.3 29.2,8.2 29.2,5.2 26.3,8.3 25.5,5.2 12,5 5.9,11.2 1.7,24.3 9.2,39.8 10.6,39.8 10,38.8 6.8,35.6 5.7,45.7 9.4,45.7 9.4,44.4 5.7,44.3 4,40.2 7.6,30.3 7.6,29 20.1,1.6 24.8,15 3.1,31.8 4.2,31.8 35,19.5 33.9,19.5 35,18.4 33.9,16.6 32,16 32,17.2 31.9,18.4 25.7,19 12.3,36.2 13.3,35.8 14.2,36.2 17,32.7 11.6,34.5 15.1,37.6 16.8,44.8 16.8,43.8 19.5,42.3 18,40.7 23.9,46.7 21.6,44.7 24.2,39.2 37.8,45.7 37.7,41.5 39.5,43 40.6,44.4 44,52.9 44,51.6 44,50.3 44,49
  pour Top: 1,60 0,60 0,0 60,0 60,60
  pour Bottom: 0,60 60,60 60,0 0,0
INA
  Top 0.305: IC2.2 42.64,51.73 R16.1 R17.2
INB
  Top 0.305: IC2.6 48.76,50.37 R26.1 R25.2
LEFT  (via drill 0.4)
  Top 0.305: R19.1 R20.1 31.2,39.08 v31.2,38.1 | U$1.P$46 19.55,36.95 19.9,37.3 19.9,37.9 v20.4,38.4
  Bottom 0.305: v20.4,38.4 31,38.2 31.1,38.1 v31.2,38.1
MISO  (via drill 0.4)
  Top 0.305: v17.7,15.3 16.89,15.3 IC1.16 | v33.9,44.7 J1.7(DAT0) | U$1.P$30 14.25,30.15 17.4,27 v19.2,27
  Bottom 0.305: v33.9,44.7 24.9,44.7 19,38.8 19,26.9 v19.2,27 19.2,16.8 v17.7,15.3
MOSI  (via drill 0.4)
  Top 0.305: v16,16.5 IC1.15 | v29.5,45.4 J1.3(CMD) | U$1.P$29 13.75,29.85 17.3,26.3 v18.42,26.3
  Bottom 0.305: v29.5,45.4 24.8,45.4 18.4,39 18.4,26.3 v18.42,26.3 18.42,17.12 17.3,16 16.6,16 16.1,16.5 v16,16.5
MP3-CS  (via drill 0.4)
  Top 0.305: U$1.P$23 11.25,32.95 11.6,32.6 v13.6,32.6 | IC1.10 12,16.3 v11,17.3
  Bottom 0.305: v13.6,32.6 13.6,29.2 9.1,24.7 9.1,19.2 v11,17.3
MP3-DCS  (via drill 0.4)
  Top 0.305: U$1.P$13 11.13,37.97 v11.4,37.7 | v11.9,17.8 12.8,16.9 IC1.11
  Bottom 0.305: v11.4,37.7 11.4,35.9 12.3,35 14,35 14.5,34.5 14.5,29.4 9.6,24.5 9.6,20.1 v11.9,17.8
MP3-DREQ  (via drill 0.4)
  Top 0.305: IC1.32 10.91,23.79 v10.4,24.3 | U$1.P$8 13.75,37.95 v13.8,37.8
  Bottom 0.305: v13.8,37.8 15.1,36.5 15.1,29 v10.4,24.3
MP3-RST  (via drill 0.4)
  Top 0.305: 16.3,40.83 R10.1 16.25,40.77 U$1.P$3 16.25,37.45 v16.2,37.2 | IC1.12 13.6,17.2 v14.4,18
  Bottom 0.305: v16.2,37.2 16.2,22 14.4,20.2 v14.4,18
N$1
  Top 0.305: R1.2 13.6,25.84 | IC1.29 13.6,25.52 R1.2 | C3.2 R1.2
N$2
  Top 0.305: C3.1 6.51,27.77 JP1.6
N$3
  Top 0.305: 17.3,10.8 LED1.A R2.2
N$4
  Top 0.305: LED2.A R3.2
N$5
  Top 0.305: LED3.A R4.2
N$6
  Top 0.305: U$1.P$25 11.62,30.82 R6.1
N$7
  Top 0.305: 19.07,30.92 R7.1 18.98,30.95 U$1.P$36
N$8
  Top 0.305: U$1.P$34 16.25,29.85 16.7,29.4 R8.1
N$9
  Top 0.305: U$1.P$33 15.75,29.65 17.3,28.1 R9.1
N$10
  Top 0.305: U$1.P$44 21.07,35.95 arc90 C5.1
N$11
  Top 0.305: U1.17 24.7,2.76 24.7,3.8 24.3,4.2 21.2,4.2 20.69,4.71 R13.1
N$12
  Top 0.305: U$1.P$26 12.25,28.23 R5.2
N$13
  Top 0.813: PWR.2 16.04,53.06 SW1.2
N$14
  Top 0.305: 50.94,36.89 C18.- | SP1.1 55.04,30.8
  Top 0.406: 50.94,36.89 SP3.2 50.94,32.16 53.5,29.6 55.65,29.6 SP1.1
N$15
  Top 0.305: X1.2 7.7,33.05 | X1.2 5.97,33.17 C7.1 3.87,33.2 3.3,33.2 2.71,33.79 R12.1 | U$1.P$18 7.85,35.45 6.7,34.3 6.7,32.45 X1.2
N$16
  Top 0.305: R19.2 C9.2
N$17
  Top 0.305: R11.2 23.93,34.7 C6.1
N$18
  Top 0.305: R18.2 14.3,49.3 12.7,47.7 11.2,47.7 11.12,47.77
  Top 0.406: 11.12,47.77 U2.1
N$19
  Top 0.305: 7.7,37.95 X1.1 6.86,38.71 | 6.86,38.71 6.17,38.02 C8.1 3.88,38 3.1,38 2.7,37.6 2.71,37.01 R12.2 | U$1.P$17 7.75,35.95 6.7,37 6.7,38.55 6.86,38.71
N$20
  Top 0.305: R20.2 C10.1
N$21  (via drill 0.4)
  Top 0.305: 36.5,38.9 C10.2 | 36.5,38.9 36.5,37.73 R21.2 | R17.1 v39.3,46.8 | v37.9,39 36.6,39 36.5,38.9
  Bottom 0.305: v39.3,46.8 38.7,46.2 38.7,39.8 v37.9,39
N$23
  Top 0.305: C15.2 R22.2
N$24
  Top 0.305: R23.2 C16.1
N$25  (via drill 0.4)
  Top 0.305: R24.2 36.38,34.33 C16.2 v39.4,34.7 | v47.7,47 48.58,47 R25.1
  Bottom 0.305: v39.4,34.7 39.4,37 41.5,39.1 41.5,41.6 46.9,47 v47.7,47
N$26
  Top 0.305: IC2.3 41.29,50.37 C20.2
N$29
  Top 0.305: 42.36,38.39 C17.-
  Top 0.406: SP2.2 42.36,38.39
N$31
  Top 0.305: R34.1 LED4.A
N$35  (via drill 0.4)
  Top 0.305: R32.2 R28.2 24.3,28.92 | 24.3,28.92 R31.1 | 24.3,28.92 24.25,28.88 C25.2 22.07,28.88 22.2,28.9 v22.1,28.9 | v35.2,23.2 35.37,23.16 IC3.6
  Bottom 0.305: v22.1,28.9 26.4,23.3 35.1,23.3 v35.2,23.2
N$36  (via drill 0.4)
  Top 0.305: R33.2 R29.2 R30.1 | R30.1 C26.2 | R30.1 25.52,21.77 v26.2,21 | v35.2,16.9 36.78,16.9 IC4.6
  Bottom 0.305: v26.2,21 30.9,21 35,16.9 v35.2,16.9
N$37
  Top 0.813: M2.2 37.5,29.44 37.5,28 38.5,26.9 38.5,21.7 37.5,20.7 31.7,20.7 31.1,20.1 31.1,19.55 IC4.1
N$38
  Top 0.813: IC4.7 38.53,18.23 39.8,19.5 39.8,27.7 M2.1
N$39
  Top 0.813: IC3.1 32.1,25.7 34,27.6 34,29.64 M1.2
N$40
  Top 0.305: 36.81,24.4 IC3.7
  Top 0.813: 35.4,28.5 35.4,27.2 34.9,26.7 34.9,25 35.5,24.4 36.81,24.4
  Top 1.016: M1.1 35.4,28.5
OUTA
  Top 0.305: 39.62,53.48 R16.2 39.38,53.5 | 40.2,52.9 40.37,52.91
  Top 0.406: IC2.1 40.37,52.91 | 39.62,53.48 40.2,52.9 | C17.+ 39.45,45.35 37.9,46.9 37.9,52.9 38.5,53.5 39.38,53.5
OUTB
  Top 0.305: 48.76,51.63 R26.2 48.92,51.6
  Top 0.406: IC2.7 48.76,51.63 | C18.+ 51,50.4 49.8,51.6 48.92,51.6
PIO1
  Top 0.305: R2.1 20.9,10.8 21.3,11.2 22.47,11.2 U1.10
PIO2
  Top 0.305: R3.1 20.7,9.4 21.3,10 22.47,10 U1.11
PIO3
  Top 0.305: R4.1 20.6,8 21.4,8.8 22.47,8.8 U1.12
RIGHT  (via drill 0.4)
  Top 0.305: 30.84,34.7 R22.1 | 30.84,34.7 R23.1 | v31.2,35.7 31.2,34.74 30.84,34.7 | U$1.P$39 19.75,33.45 20,33.7 23,33.7 v23.1,33.6
  Bottom 0.305: v31.2,35.7 25.2,35.7 v23.1,33.6
RIN1  (via drill 0.4)
  Top 0.305: IC1.24 19.8,22.3 21.5,20.6 21.5,18.9 22.7,17.7 v24,17.7 | v35.3,22 36.74,22 IC3.5
  Bottom 0.305: v24,17.7 24,20.3 25.5,21.7 35,21.7 v35.3,22
RIN2
  Top 0.305: IC1.26 16,23.1 16.3,22.8 17.2,22.8 17.5,23.1 19.9,23.1 22.1,20.9 22.1,19.1 22.8,18.4 24.4,18.4 27.9,14.9 32.3,14.9 33.09,15.7 IC4.5 36.76,15.6
RXD
  Top 0.305: IC1.30 12.8,23 12.6,22.8 10.7,22.8 9.5,24 5.97,24 JP1.4
SCK  (via drill 0.4)
  Top 0.305: v17,16.7 IC1.17 | v31.7,46.2 J1.5(CLK) | U$1.P$28 13.25,29.55 17.2,25.6 v17.64,25.6
  Bottom 0.305: v17,16.7 17.45,17.14 17.45,25.4 v17.64,25.6 17.64,25.71 arc45 17.6,25.82 | v31.7,46.2 24.8,46.2 17.8,39.2 17.8,26.8 17.6,26.6 17.6,25.82 | 17.6,25.82 17.6,25.8
SD-CS  (via drill 0.4)
  Top 0.305: J1.2(CD/DAT3) v28.4,42.3 | 14.5,15.3 IC1.13 v14.4,14.2
  Bottom 0.305: v14.4,14.2 17.7,14.2 20,16.5 20,27.4 19.6,27.8 19.6,38.6 23.2,42.3 v28.4,42.3
SHUTDOWN  (via drill 0.4)
  Top 0.305: IC2.5 46.95,48.45 v46.9,48.1 | IC1.14 15.2,14.12 15.53,13.8 | R27.1 15.53,13.8 | v14.9,13.4 15.3,13.8 15.53,13.8
  Bottom 0.305: v46.9,48.1 46.9,48 40.5,41.6 40.5,40.5 34.9,34.9 25.6,34.9 23.6,32.9 22.6,32.9 20.6,30.9 20.6,16.3 17.7,13.4 v14.9,13.4
TXD
  Top 0.305: 5.75,26 JP1.5 5.7,26 6.7,25 11.6,25 12,24.6 IC1.31
VCC
  Top 0.305: 29.27,24.43 29.2,24.5 29.3,24.2 | 29.3,24.2 C23.1 | 29.21,23.16 C21.1 | 28.98,24.57 29.3,24.2 | 29.21,16.96 C22.1 | C24.1 29.18,18.98 | 29.24,18.23 29.18,18.17 | 45.27,54.2 C19.1 45.27,54.39 | 45.27,54.39 45.27,54.42 | 26.2,39.2 26.4,39.2 | 45.2,54.32 45.27,54.39 | C11.2 16.7,49.23 R18.1
  Top 0.406: 19.54,46.26 SW1.1 | 16.77,47.8 C11.2 16.52,47.7
  Top 0.508: 19.54,46.26 18,47.8 16.77,47.8 | 16.52,47.7 U2.5
  Top 0.61: 26.4,39.2 27.7,40.5 38.6,40.5 40.3,42.2 44,42.2 45.2,43.4 45.2,54.32 | C19.1 45.95,54.4 46.8,53.6 46.95,53.45 IC2.8
  Top 1.016: 29.27,24.43 IC3.2 | IC3.3 29.21,23.16 | 28.98,24.57 C21.1 28.98,19.73 C24.1 | IC4.3 29.21,16.96 | C22.1 29.18,18.17 29.18,18.98 | IC4.2 29.24,18.23
  Top 1.27: SW1.1 22.24,46.26 23.4,45.1 23.4,42 26.2,39.2 26.2,32.8 25.7,32.3 25.7,28 29.27,24.43
VREF1  (via drill 0.4)
  Top 0.305: IC1.1 v7.1,22.7 | v22.1,31.4 22.1,31.5 22.6,32 23.07,32 R32.1
  Bottom 0.305: v7.1,22.7 4.5,22.7 3.8,22 3.8,18.3 4.5,17.6 6.6,17.6 7.1,17.1 7.1,13.8 14.7,6.2 23,6.2 27.4,10.6 27.4,13 26.1,14.3 23.9,14.3 22.2,16 22.2,25.3 21.2,26.3 21.2,30.5 v22.1,31.4
VREF2  (via drill 0.4)
  Top 0.305: IC1.9 11.2,15 11.2,14.7 12,13.9 v12.6,13.9 | v21.4,24.9 23.48,24.9 R33.1
  Bottom 0.305: v12.6,13.9 12.6,13.8 14.4,12 19.3,12 21.2,13.9 21.2,24.8 v21.4,24.9
WAKE_HW  (via drill 0.4)
  Top 0.305: 22.28,5.22 U1.15 | 22.28,5.22 21.68,5.22 20.8,6.1 R15.2 | IC1.19 v16.5,18.3 16.6,18.3 | v18.8,12.7 23.3,12.7 23.7,12.3 23.7,5.5 23.4,5.2 22.3,5.2 22.28,5.22
  Bottom 0.305: v16.5,18.3 13.4,15.2 13.4,13.9 14.6,12.7 v18.8,12.7
WAKE_SW  (via drill 0.4)
  Top 0.305: 25.93,13.73 U1.7 | IC1.22 16.7,20.7 v16.7,20.8 | U1.7 25.9,13.66 v25.9,12.5 | U1.7 25.94,15.16 25.2,15.9 24.05,15.9 R14.2
  Bottom 0.305: v16.7,20.8 15.1,19.2 15.1,17.7 11.9,14.5 11.9,13.6 14,11.5 24.9,11.5 v25.9,12.5

### Text on the board
tPlace: - | + | M1 | M2 | SP2 | SP3 | 3V3 | GND | KENBISHI | SPHERE_ROBO | Rev1